# EAGLE design PCB-CobraPID (EAGLE 9.6.2)
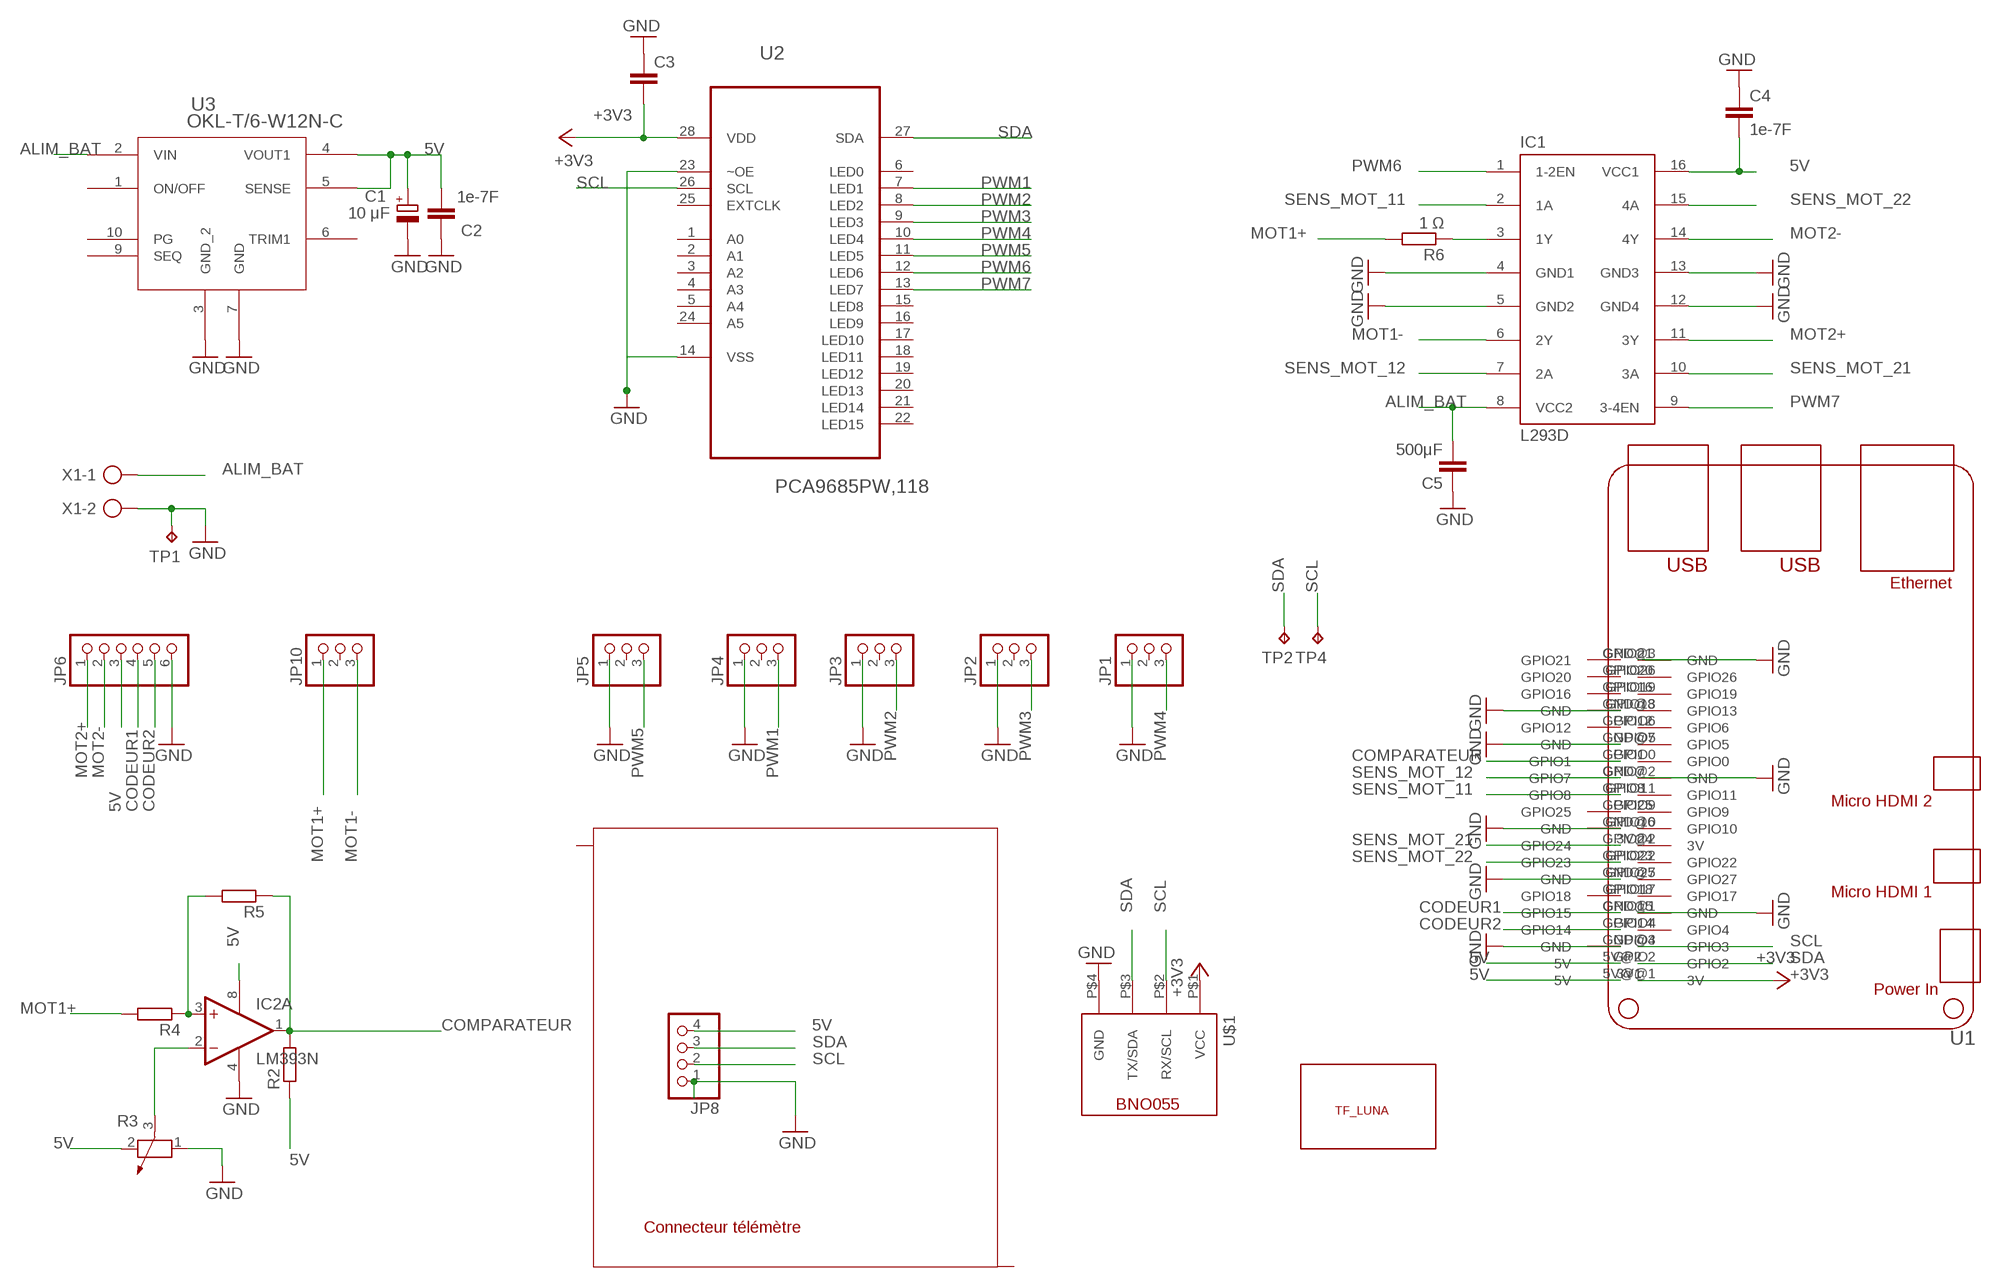
[diagram p0: schematic, sheet 1]

## Parts
C1  10 μF  CPOL-EUE5-10.5  [E5-10,5]
C2  1e-7F  C-EUC1206  [C1206]
C3  C-EUC1206  [C1206]
C4  1e-7F  C-EUC1206  [C1206]
C5  500μF  C-EUC1206  [C1206]
IC1  L293D  [DIL16]
IC2  LM393N  [DIL08]
JP1  PINHD-1X3/90  [1X03/90]
JP2  PINHD-1X3/90  [1X03/90]
JP3  PINHD-1X3/90  [1X03/90]
JP4  PINHD-1X3/90  [1X03/90]
JP5  PINHD-1X3/90  [1X03/90]
JP6  PINHD-1X6/90  [1X06/90]
JP8  PINHD-1X4  [1X04]
JP10  PINHD-1X3/90  [1X03/90]
R2  R-EU_R1206  [R1206]
R3  POTENTIOMETER_PT-10  [PT-10]
R4  R-EU_R1206  [R1206]
R5  R-EU_R1206  [R1206]
R6  1 Ω  R-EU_R1206  [R1206]
TP1  TPPAD1-17  [P1-17]
TP2  TPPAD1-17  [P1-17]
TP4  TPPAD1-17  [P1-17]
U1  RPI5  [RPI5]
U2  PCA9685PW,118  [SOP65P640X110-28N]
U3  OKL-T/6-W12N-C  [OKL-T/6-W12N-C_MUR]
U$1  MODULE_BNO055  [MODULE_BNO055]
U$2  TF_LUNA  [TF_LUNA]
X1  AK500/2  [AK500/2]

## Nets
5V: C1.+ C2.2 C4.2 IC1.16(VCC1) IC2.8(P:V+) JP6.3 JP8.4 R2.1 R3.2 U1.5V@1(5V) U1.5V@2(5V) U3.4(VOUT1) U3.5(SENSE)
+3V3: C3.2 U1.3V@1(3V) U2.28(VDD) U$1.P$1(VCC)
ALIM_BAT: C5.2 IC1.8(VCC2) U3.2(VIN) X1.1
CODEUR1: JP6.4 U1.GPIO15
CODEUR2: JP6.5 U1.GPIO14
COMPARATEUR: IC2.1(A:OUT) R2.2 R5.1 U1.GPIO1
GND: C1.- C2.1 C3.1 C4.1 C5.1 IC1.4(GND1) IC1.5(GND2) IC1.12(GND4) IC1.13(GND3) IC2.4(P:V-) JP1.1 JP2.1 JP3.1 JP4.1 JP6.6 JP8.1 R3.1 TP1.TP U1.GND@1(GND) U1.GND@2(GND) U1.GND@3(GND) U1.GND@4(GND) U1.GND@5(GND) U1.GND@6(GND) U1.GND@7(GND) U1.GND@8(GND) U2.14(VSS) U2.23(~OE) U3.3(GND_2) U3.7(GND) U$1.P$4(GND) X1.2
GND1: JP5.1 ; supply symbol labelled GND
MOT1+: JP10.1 R4.2 R6.2
MOT1-: IC1.6(2Y) JP10.3
MOT2+: IC1.11(3Y) JP6.1
MOT2-: IC1.14(4Y) JP6.2
N$3: IC2.3(A:+IN) R4.1 R5.2
N$4: IC2.2(A:-IN) R3.3
N$5: IC1.3(1Y) R6.1
PWM1: JP4.3 U2.7(LED1)
PWM2: JP3.3 U2.8(LED2)
PWM3: JP2.3 U2.9(LED3)
PWM4: JP1.3 U2.10(LED4)
PWM5: JP5.3 U2.11(LED5)
PWM6: IC1.1(1-2EN) U2.12(LED6)
PWM7: IC1.9(3-4EN) U2.13(LED7)
SCL: JP8.2 TP4.TP U1.GPIO3 U2.26(SCL) U$1.P$2(RX/SCL)
SDA: JP8.3 TP2.TP U1.GPIO2 U2.27(SDA) U$1.P$3(TX/SDA)
SENS_MOT_11: IC1.2(1A) U1.GPIO8
SENS_MOT_12: IC1.7(2A) U1.GPIO7
SENS_MOT_21: IC1.10(3A) U1.GPIO24
SENS_MOT_22: IC1.15(4A) U1.GPIO23
Unconnected: IC2.5(B:+IN) IC2.6(B:-IN) IC2.7(B:OUT) JP1.2 JP2.2 JP3.2 JP4.2 JP5.2 JP10.2 U1.3V@2(3V) U1.GPIO0 U1.GPIO4 U1.GPIO5 U1.GPIO6 U1.GPIO9 U1.GPIO10 U1.GPIO11 U1.GPIO12 U1.GPIO13 U1.GPIO16 U1.GPIO17 U1.GPIO18 U1.GPIO19 U1.GPIO20 U1.GPIO21 U1.GPIO22 U1.GPIO25 U1.GPIO26 U1.GPIO27 U2.1(A0) U2.2(A1) U2.3(A2) U2.4(A3) U2.5(A4) U2.6(LED0) U2.15(LED8) U2.16(LED9) U2.17(LED10) U2.18(LED11) U2.19(LED12) U2.20(LED13) U2.21(LED14) U2.22(LED15) U2.24(A5) U2.25(EXTCLK) U3.1(ON/OFF) U3.6(TRIM1) U3.9(SEQ) U3.10(PG)

## Notes on the sheet
- Connecteur télémètre

## Library data of the parts
C1 = rcl:CPOL-EU: POLARIZED CAPACITOR, European symbol; SPICEPREFIX: C
C2-C5 = rcl:C-EU: CAPACITOR, European symbol; SPICEPREFIX: C
IC1 = st-microelectronics:L293D: PUSH-PULL 4 CHANNEL DRIVER; MPN: L293D; OC_FARNELL: 9589619; OC_NEWARK: 56P8249
IC2 = linear:LM393: COMPARATOR
JP1-JP5 JP10 = pinhead:PINHD-1X3: PIN HEADER
JP6 = pinhead:PINHD-1X6: PIN HEADER
JP8 = pinhead:PINHD-1X4: PIN HEADER
R2 R4-R6 = rcl:R-EU_: RESISTOR, European symbol; SPICEPREFIX: R
R3 = rcl:POTENTIOMETER_: Potentiometer; SPICEMODEL: POT; SPICEPREFIX: X
TP1 TP2 TP4 = testpad:TP: Test pad
U1 = RaspberryPI:RPI5: Raspberry Pi Eagle Library Raspberry Pi Eagle Library This library provides GPIO header layouts and board outlines specifically designed for the Raspberry Pi 5. It is also compatible with the Raspberry Pi 4 and Raspberry Pi 3 models. Compatibility Designed for Raspberry Pi 5 Fully compatible with Raspberry Pi 4 and 3 models Uses standard 0.1 inch (2.54 mm) grid for seamless integration with common PCB components Applications Perfect for designing HATs, add-on boards, and prototyping projects for the Raspberry Pi platform. About the Author Created by Mert Batuhan Şahin. You can find more of my projects and contributions on GitHub <https://github.com/Batushn>. Notes This library ensures accurate GPIO header placements and general compatibility across different Raspberry Pi models, making it an essential tool for engineers and makers.
U2 = PCA9685PW_118:PCA9685PW,118: Check availability <https://pricing.snapeda.com/parts/PCA9685PW%2C118/NXP%20USA/view-part?ref=eda>; AVAILABILITY: In Stock; CHECK_PRICES: https://www.snapeda.com/parts/PCA9685PW,118/NXP+Semiconductors/view-part/?ref=eda; DESCRIPTION: LED Driver IC 16 Output Linear - PWM Dimming 25mA 28-TSSOP; MF: NXP USA; MP: PCA9685PW,118; PACKAGE: TSSOP-28 NXP Semiconductors; PRICE: None; SNAPEDA_LINK: https://www.snapeda.com/parts/PCA9685PW,118/NXP+Semiconductors/view-part/?ref=snap
U3 = OKL_T6_W12N_C:OKL-T/6-W12N-C; COPYRIGHT: Copyright (C) 2025 Ultra Librarian. All rights reserved.; MANUFACTURER_PART_NUMBER: OKL-T/6-W12N-C; MFR_NAME: Murata
U$1 = lib_ens_aj_v1:MODULE_BNO055
U$2 = TF_LUNA:TF_LUNA
X1 = con-ptr500:AK500/2: CONNECTOR; OC_FARNELL: unknown; OC_NEWARK: unknown

## Board
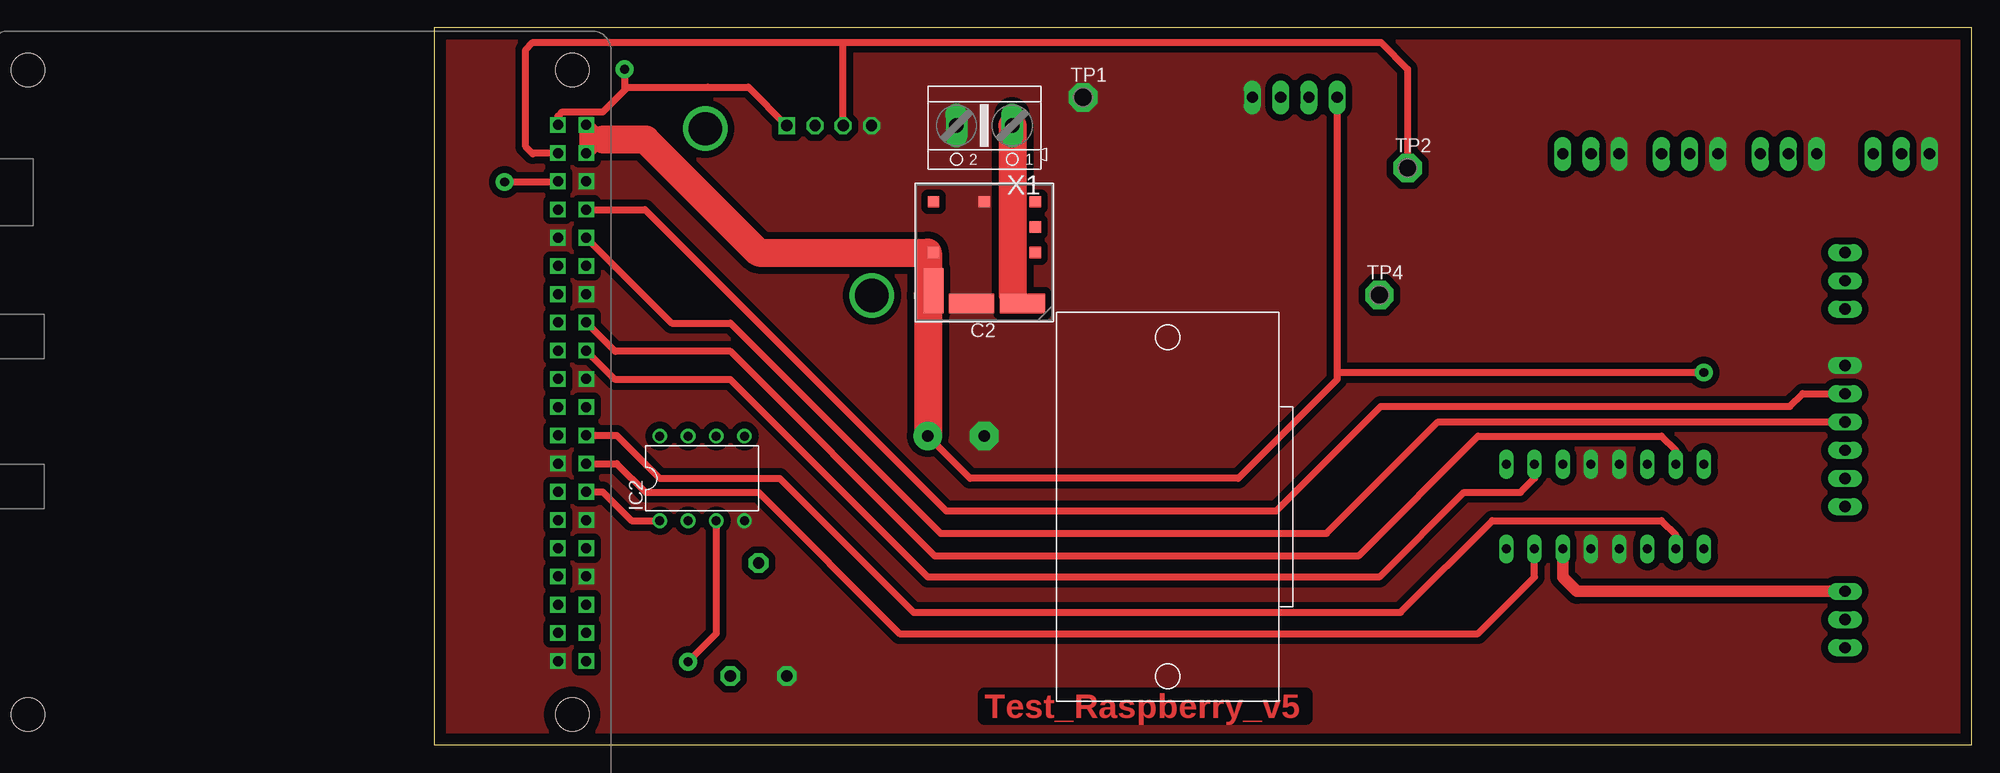
[diagram p1: board, top side]
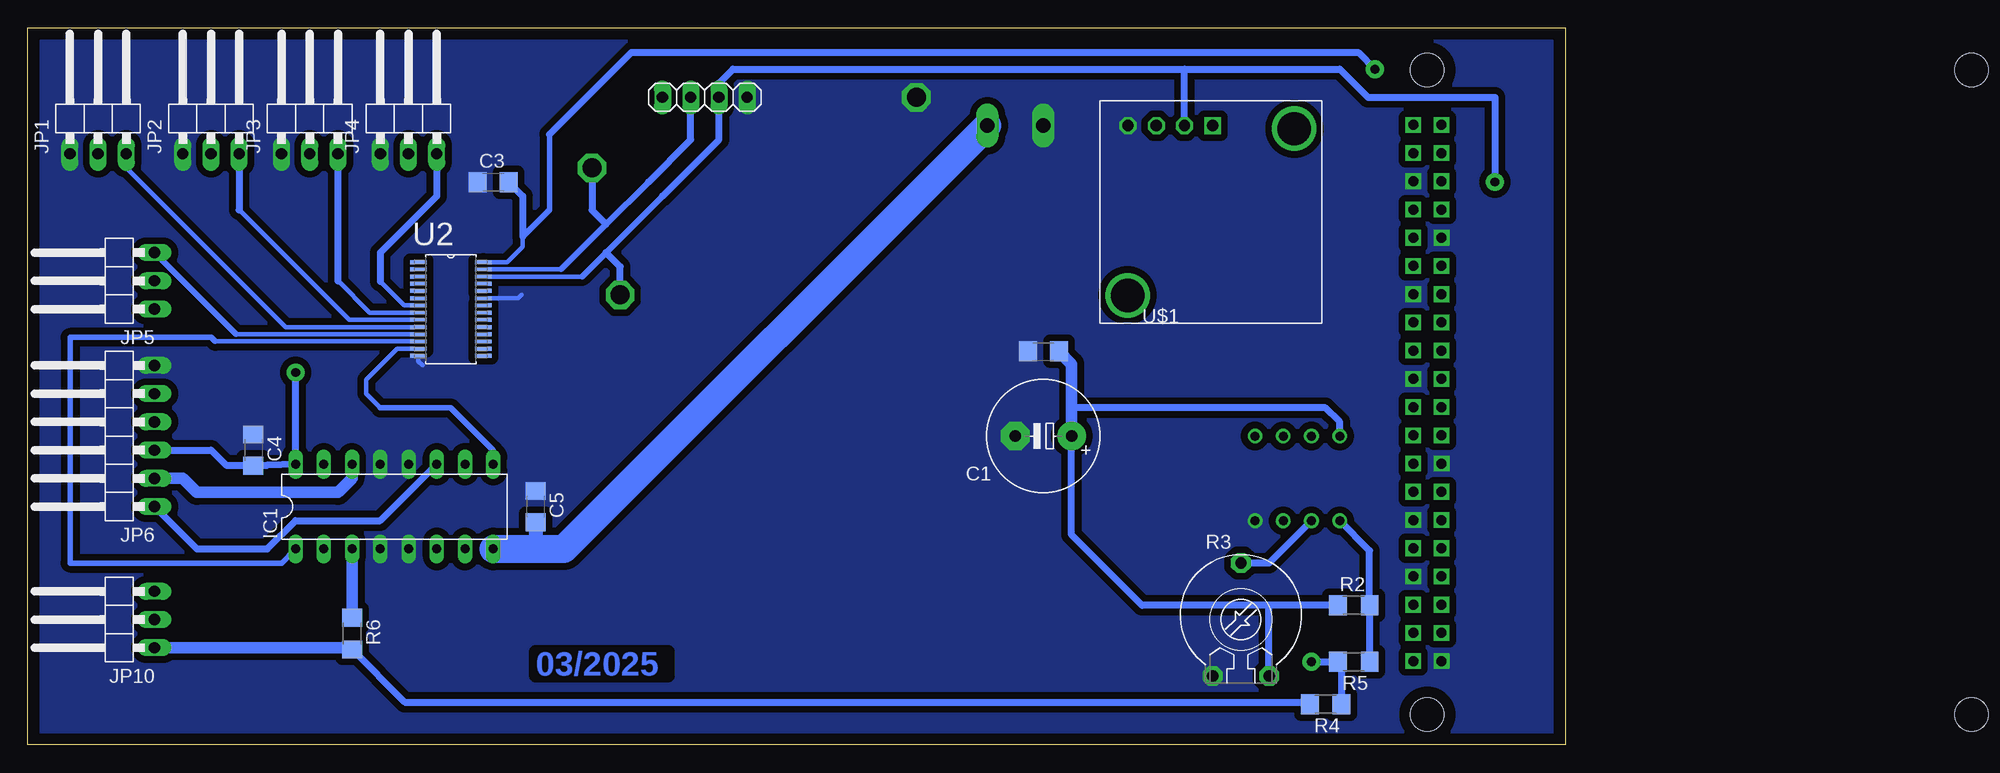
[diagram p2: board, bottom side, seen from below]

Size 138.41 x 64.54 mm. Coordinates in mm from the lower left corner, seen from the top.
Outline: 0,0 138.41,0 138.41,64.54 0,64.54 0,0
Copper layers (1*16): Top 0.035mm / dielectric 1.5mm / Bottom 0.035mm
Design rules "default": minimum track width 6mil, minimum drill 0.35mm, track to track 6mil, track to pad 6mil, pad to pad 6mil, via to via 6mil, smd to smd 6mil, copper to edge 40mil, drill to drill 6mil, minimum pad ring 10mil, minimum via ring 8mil, stop-mask expansion 4mil, vias tented up to drill 0mil, thermal gap 10mil

### Footprints (pad centres in the part's own frame; a part is rotated, then mirrored left to right if it is on the bottom)
E5-10,5 = drill 1.016 pad 2.54: + -2.54,0 | drill 1.016 pad 2.54 octagon: - 2.54,0
C1206 = smd 1.6 x 1.8: 1 -1.4,0; 2 1.4,0
DIL16 = drill 0.813 long: 1 -8.89,-3.81; 2 -6.35,-3.81; 3 -3.81,-3.81; 4 -1.27,-3.81; 5 1.27,-3.81; 6 3.81,-3.81; 7 6.35,-3.81; 8 8.89,-3.81; 9 8.89,3.81; 10 6.35,3.81; 11 3.81,3.81; 12 1.27,3.81; 13 -1.27,3.81; 14 -3.81,3.81; 15 -6.35,3.81; 16 -8.89,3.81
DIL08 = drill 0.813 pad 1.27: 1 -3.81,-3.81; 2 -1.27,-3.81; 3 1.27,-3.81; 4 3.81,-3.81; 5 3.81,3.81; 6 1.27,3.81; 7 -1.27,3.81; 8 -3.81,3.81
1X03/90 = drill 1.016 long: 1 -2.54,-3.81; 2 0,-3.81; 3 2.54,-3.81
1X06/90 = drill 1.016 long: 1 -6.35,-3.81; 2 -3.81,-3.81; 3 -1.27,-3.81; 4 1.27,-3.81; 5 3.81,-3.81; 6 6.35,-3.81
1X04 = drill 1.016 long: 1 -3.81,0; 2 -1.27,0; 3 1.27,0; 4 3.81,0
R1206 = smd 1.6 x 1.803: 1 -1.422,0; 2 1.422,0
PT-10 = drill 1.016 pad 1.778 octagon: 1 -2.54,-5.08; 2 2.54,-5.08; 3 0,5.08
P1-17 = drill 1.702 pad 2.54 octagon: TP 0,0
RPI5 = drill 0.9 square: 3V@1 -0.27,0.064; 3V@2 -0.27,-20.256; 5V@1 2.27,0.064; 5V@2 2.27,-2.477; GND@1 -0.27,-10.097; GND@2 -0.27,-30.416; GND@3 -0.27,-48.197; GND@4 2.27,-5.016; GND@5 2.27,-15.177; GND@6 2.27,-22.797; GND@7 2.27,-35.496; GND@8 2.27,-40.577; GPIO0 -0.27,-32.956; GPIO1 2.27,-32.956; GPIO2 -0.27,-2.477; GPIO3 -0.27,-5.016; GPIO4 -0.27,-7.556; GPIO5 -0.27,-35.496; GPIO6 -0.27,-38.036; GPIO7 2.27,-30.416; GPIO8 2.27,-27.877; GPIO9 -0.27,-25.337; GPIO10 -0.27,-22.797; GPIO11 -0.27,-27.877; GPIO12 2.27,-38.036; GPIO13 -0.27,-40.577; GPIO14 2.27,-7.556; GPIO15 2.27,-10.097; GPIO16 2.27,-43.117; GPIO17 -0.27,-12.636; GPIO18 2.27,-12.636; GPIO19 -0.27,-43.117; GPIO20 2.27,-45.657; GPIO21 2.27,-48.197; GPIO22 -0.27,-17.716; GPIO23 2.27,-17.716; GPIO24 2.27,-20.256; GPIO25 2.27,-25.337; GPIO26 -0.27,-45.657; GPIO27 -0.27,-15.177 | hole 3: 1,5; 1,-53; -48,5; -48,-53
SOP65P640X110-28N = smd 1.473 x 0.356: 1 -2.921,4.216; 2 -2.921,3.581; 3 -2.921,2.921; 4 -2.921,2.286; 5 -2.921,1.626; 6 -2.921,0.965; 7 -2.921,0.33; 8 -2.921,-0.33; 9 -2.921,-0.965; 10 -2.921,-1.626; 11 -2.921,-2.286; 12 -2.921,-2.921; 13 -2.921,-3.581; 14 -2.921,-4.216; 15 2.921,-4.216; 16 2.921,-3.581; 17 2.921,-2.921; 18 2.921,-2.286; 19 2.921,-1.626; 20 2.921,-0.965; 21 2.921,-0.33; 22 2.921,0.33; 23 2.921,0.965; 24 2.921,1.626; 25 2.921,2.286; 26 2.921,2.921; 27 2.921,3.581; 28 2.921,4.216
OKL-T/6-W12N-C_MUR = smd 1.016 x 1.016: 1 -4.575,0; 5 4.575,0; 6 4.575,-4.58; 7 0,-4.58; 9 -4.575,-4.58; 10 -4.575,-2.29 | smd 4.064 x 1.778: 2 -3.43,4.574; 3 1.14,4.574 | smd 1.778 x 4.064: 4 4.57,3.431
MODULE_BNO055 = drill 1.016 pad 1.5 square: P$1 10.16,17.78 | drill 1.016 pad 1.5 octagon: P$2 7.62,17.78; P$3 5.08,17.78; P$4 2.54,17.78 | drill 3: P$5 17.5,17.5; P$6 2.5,2.5
AK500/2 = drill 1.321 long: 1 -2.515,0; 2 2.515,0

### Placement (x,y rotation side)
C1  46.99,27.8 180 bottom
C2  46.99,35.42 0 bottom
C3  96.52,50.66 0 bottom
C4  118.11,26.53 270 bottom
C5  92.71,21.45 270 bottom
IC1  105.41,21.45 0 bottom
IC2  24.13,23.99 0 top
JP1  132.08,57.01 0 bottom
JP2  121.92,57.01 0 bottom
JP3  113.03,57.01 0 bottom
JP4  104.14,57.01 0 bottom
JP5  130.81,41.77 90 bottom
JP6  130.81,27.8 90 bottom
JP8  77.47,58.28 180 bottom
JP10  130.81,11.29 90 bottom
R2  19.05,12.56 0 bottom
R3  29.21,11.29 0 bottom
R4  21.59,3.67 180 bottom
R5  19.05,7.48 180 bottom
R6  109.22,10.02 270 bottom
TP1  58.42,58.28 0 top
TP2  87.63,51.93 0 top
TP4  85.09,40.5 0 top
U1  11.43,55.74 0 top
U2  100.33,39.23 0 bottom
U3  49.53,44.31 180 top
U$1  41.91,37.96 0 bottom
U$2  66.04,21.45 90 top
X1  49.53,55.74 180 top

### Tracks (layer width: path | path; a pad name or v marks a point on that pad's centre or on a via)
5V  (via drill 0.8 pad 1.6)
  Top 0.61: v114.3,33.52 81.28,33.52 | U3.4 44.45,40.37 | JP8.4 81.28,33.52 | 81.28,33.52 81.28,32.88 72.39,23.99 48.26,23.99 C1.+ 44.45,32.88
  Top 1.016: 44.45,40.5 44.58,40.5 U3.4
  Top 1.27: U3.4 U3.5 | 15.03,54.47 U1.5V@1 U1.5V@2 14.91,54.47 15.03,54.47 | 15.03,54.47 15.24,54.47
  Top 2.54: 15.24,54.47 19.05,54.47 29.21,44.31 44.45,44.31 44.45,40.5 | 44.45,40.37 C1.+
  Bottom 0.61: 20.47,12.41 R2.1 26.67,12.56 | v114.3,33.52 IC1.16 116.84,25.17 | 116.84,25.17 C4.2 | IC2.8 20.32,29.07 21.59,30.34 44.45,30.34 | JP6.3 121.92,26.53 120.56,25.17 116.84,25.17 | 26.67,12.56 38.1,12.56 44.45,18.91 C1.+ | R3.2 26.67,12.56
  Bottom 1.016: C2.2 44.45,34.28 44.45,30.34 C1.+
+3V3  (via drill 0.8 pad 1.6)
  Top 0.61: v17.15,60.82 17.15,58.92 | 17.15,58.92 15.2,56.97 11.54,56.97 11.16,56.59 U1.3V@1 | U$1.P$1 28.3,59.19 24.66,59.19 24.65,59.19 17.42,59.19 17.15,58.92
  Bottom 0.406: U2.28 97.38,43.42 95.25,43.42 93.85,44.82 93.85,45.73
  Bottom 0.508: 93.85,45.73 91.44,48.14 91.44,54.95
  Bottom 0.61: C3.2 93.85,49.39 93.85,45.73 | 91.44,54.95 84.06,62.33 18.66,62.33 v17.15,60.82
ALIM_BAT
  Top 0.61: 52.07,40.5 52.83,39.74 U3.2
  Top 2.54: X1.1 52.07,55.72 52.07,40.5
  Bottom 1.27: C5.2 92.71,17.64
  Bottom 2.54: IC1.8 92.71,17.64 90.15,17.64 X1.1
CODEUR1
  Top 0.61: U1.GPIO15 21.38,37.96 26.67,37.96 45.59,19.04 80.33,19.04 90.36,29.07 JP6.4
CODEUR2
  Top 0.61: U1.GPIO14 18.99,48.18 46.1,21.07 75.82,21.07 85.22,30.47 122.05,30.47 123.19,31.61 JP6.5
COMPARATEUR
  Top 0.61: U1.GPIO1 15.18,22.78 17.78,20.18 IC2.1
  Bottom 0.61: R2.2 R5.1 | 17.78,12.71 R2.2 | R2.2 17.63,17.49 IC2.1
GND
  Bottom 0.406: U2.23 94.28,40.2 93.98,40.5 | U2.14 103.25,34.53 102.87,34.15
  pour Bottom (isolate 0.61, no thermals): 1.27,63.36 137.16,63.36 137.16,-0.14 1.27,-0.14
  pour Top (isolate 0.61, no thermals): 1.27,63.36 137.16,63.36 138.43,62.09 138.43,-0.14 1.27,-0.14
MOT1+
  Bottom 0.61: R6.2 104.48,3.86 23.2,3.86 R4.2
  Bottom 1.016: R6.2 109.37,8.75 JP10.1
MOT1-
  Top 1.016: JP10.3 102.87,13.83 101.6,15.1 IC1.6
MOT2+
  Bottom 0.61: IC1.11 106.68,20.18 114.3,20.18 116.84,17.64 123.19,17.64 JP6.1
MOT2-
  Bottom 1.016: IC1.14 109.22,23.99 110.49,22.72 123.19,22.72 124.46,23.99 JP6.2
N$3  (via drill 0.8 pad 1.6)
  Top 0.61: IC2.3 25.4,10.02 v22.86,7.48
  Bottom 0.61: R5.2 20.17,7.18 R4.1 | 21,8.01 R5.2 | v22.86,7.48 R5.2
N$4
  Bottom 0.61: IC2.2 26.67,16.37 R3.3
N$5
  Bottom 1.016: IC1.3 R6.1 109.22,11.29
PWM1
  Bottom 0.406: U2.7 104.52,39.56 106.68,41.72
  Bottom 0.61: JP4.3 101.6,49.39 106.68,44.31 106.68,41.72
PWM2
  Bottom 0.406: U2.8 107.62,38.9 110.49,41.77
  Bottom 0.61: 110.49,41.77 JP3.3
PWM3
  Bottom 0.406: U2.9 109.48,38.27 119.38,48.16
  Bottom 0.61: JP2.3 119.38,48.16
PWM4
  Bottom 0.406: U2.10 115.21,37.6 129.54,51.93
  Bottom 0.508: 129.54,51.93 JP1.3
PWM5
  Bottom 0.406: U2.11 119.63,36.94
  Bottom 0.508: 119.63,36.94 JP5.3
PWM6
  Bottom 0.406: 121.54,36.31 U2.12
  Bottom 0.508: 121.54,36.31 121.92,36.69 134.6,36.69 134.6,16.37 115.57,16.37 IC1.1
PWM7
  Bottom 0.406: U2.13 105.18,35.65 107.95,32.88 107.95,31.61 106.68,30.34
  Bottom 0.508: 106.68,30.34 100.33,30.34 96.52,26.53 IC1.9
SCL  (via drill 0.8 pad 1.6)
  Top 0.61: 11.1,50.66 v6.35,50.66
  Top 0.813: U1.GPIO3 11.1,50.66
  Bottom 0.406: U2.26 88.52,42.15
  Bottom 0.508: 88.52,42.15 86.36,44.31 81.28,49.39
  Bottom 0.61: TP4.TP 85.09,43.04 86.36,44.31 | 81.28,49.39 76.2,54.47 JP8.2 76.2,59.55 74.93,60.82 34.29,60.82 | U$1.P$2 34.29,60.82 | 34.29,60.82 20.32,60.82 17.78,58.28 6.35,58.28 v6.35,50.66
SDA
  Top 0.61: U1.GPIO2 8.95,53.26 8.89,53.2 8.26,53.83 8.26,62.58 8.89,63.22 36.83,63.22 | 36.83,63.22 85.23,63.22 87.63,60.82 TP2.TP | U$1.P$3 36.83,63.22
  Bottom 0.406: U2.27 90.4,42.81
  Bottom 0.508: 90.4,42.81 86.36,46.85 82.55,50.66
  Bottom 0.61: TP2.TP 87.63,48.12 86.36,46.85 | 82.55,50.66 78.74,54.47 JP8.3
SENS_MOT_11
  Top 0.61: 13.97,27.8 13.76,27.8 U1.GPIO8 16.45,27.86 20.32,23.99 31.12,23.99 43.18,11.92 87,11.92 95.25,20.18 110.49,20.18 111.76,18.91 IC1.2
SENS_MOT_12
  Top 0.61: 13.8,25.43 U1.GPIO7 16.45,25.32 19.05,22.72 29.21,22.72 41.91,10.02 93.98,10.02 99.06,15.1 IC1.7
SENS_MOT_21
  Top 0.61: U1.GPIO24 16.3,32.88 26.67,32.88 44.45,15.1 85.09,15.1 92.71,22.72 97.79,22.72 99.06,23.99 IC1.10
SENS_MOT_22
  Top 0.61: U1.GPIO23 16.3,35.42 26.67,35.42 45.09,17.01 83.19,17.01 93.98,27.8 110.49,27.8 111.76,26.53 IC1.15

### Text on the board
Top: Test_Raspberry_v5
Bottom: 03/2025